# EasyEDA schematic Scout-EasyEDA.json

## Sheets
1 Power-Charge: TITLE: Power/Charge; REV: 1.0; Date: 2020-01-04; Sheet: 1/1; Drawn By: rupertbenbrook; Company: Altitude Angel
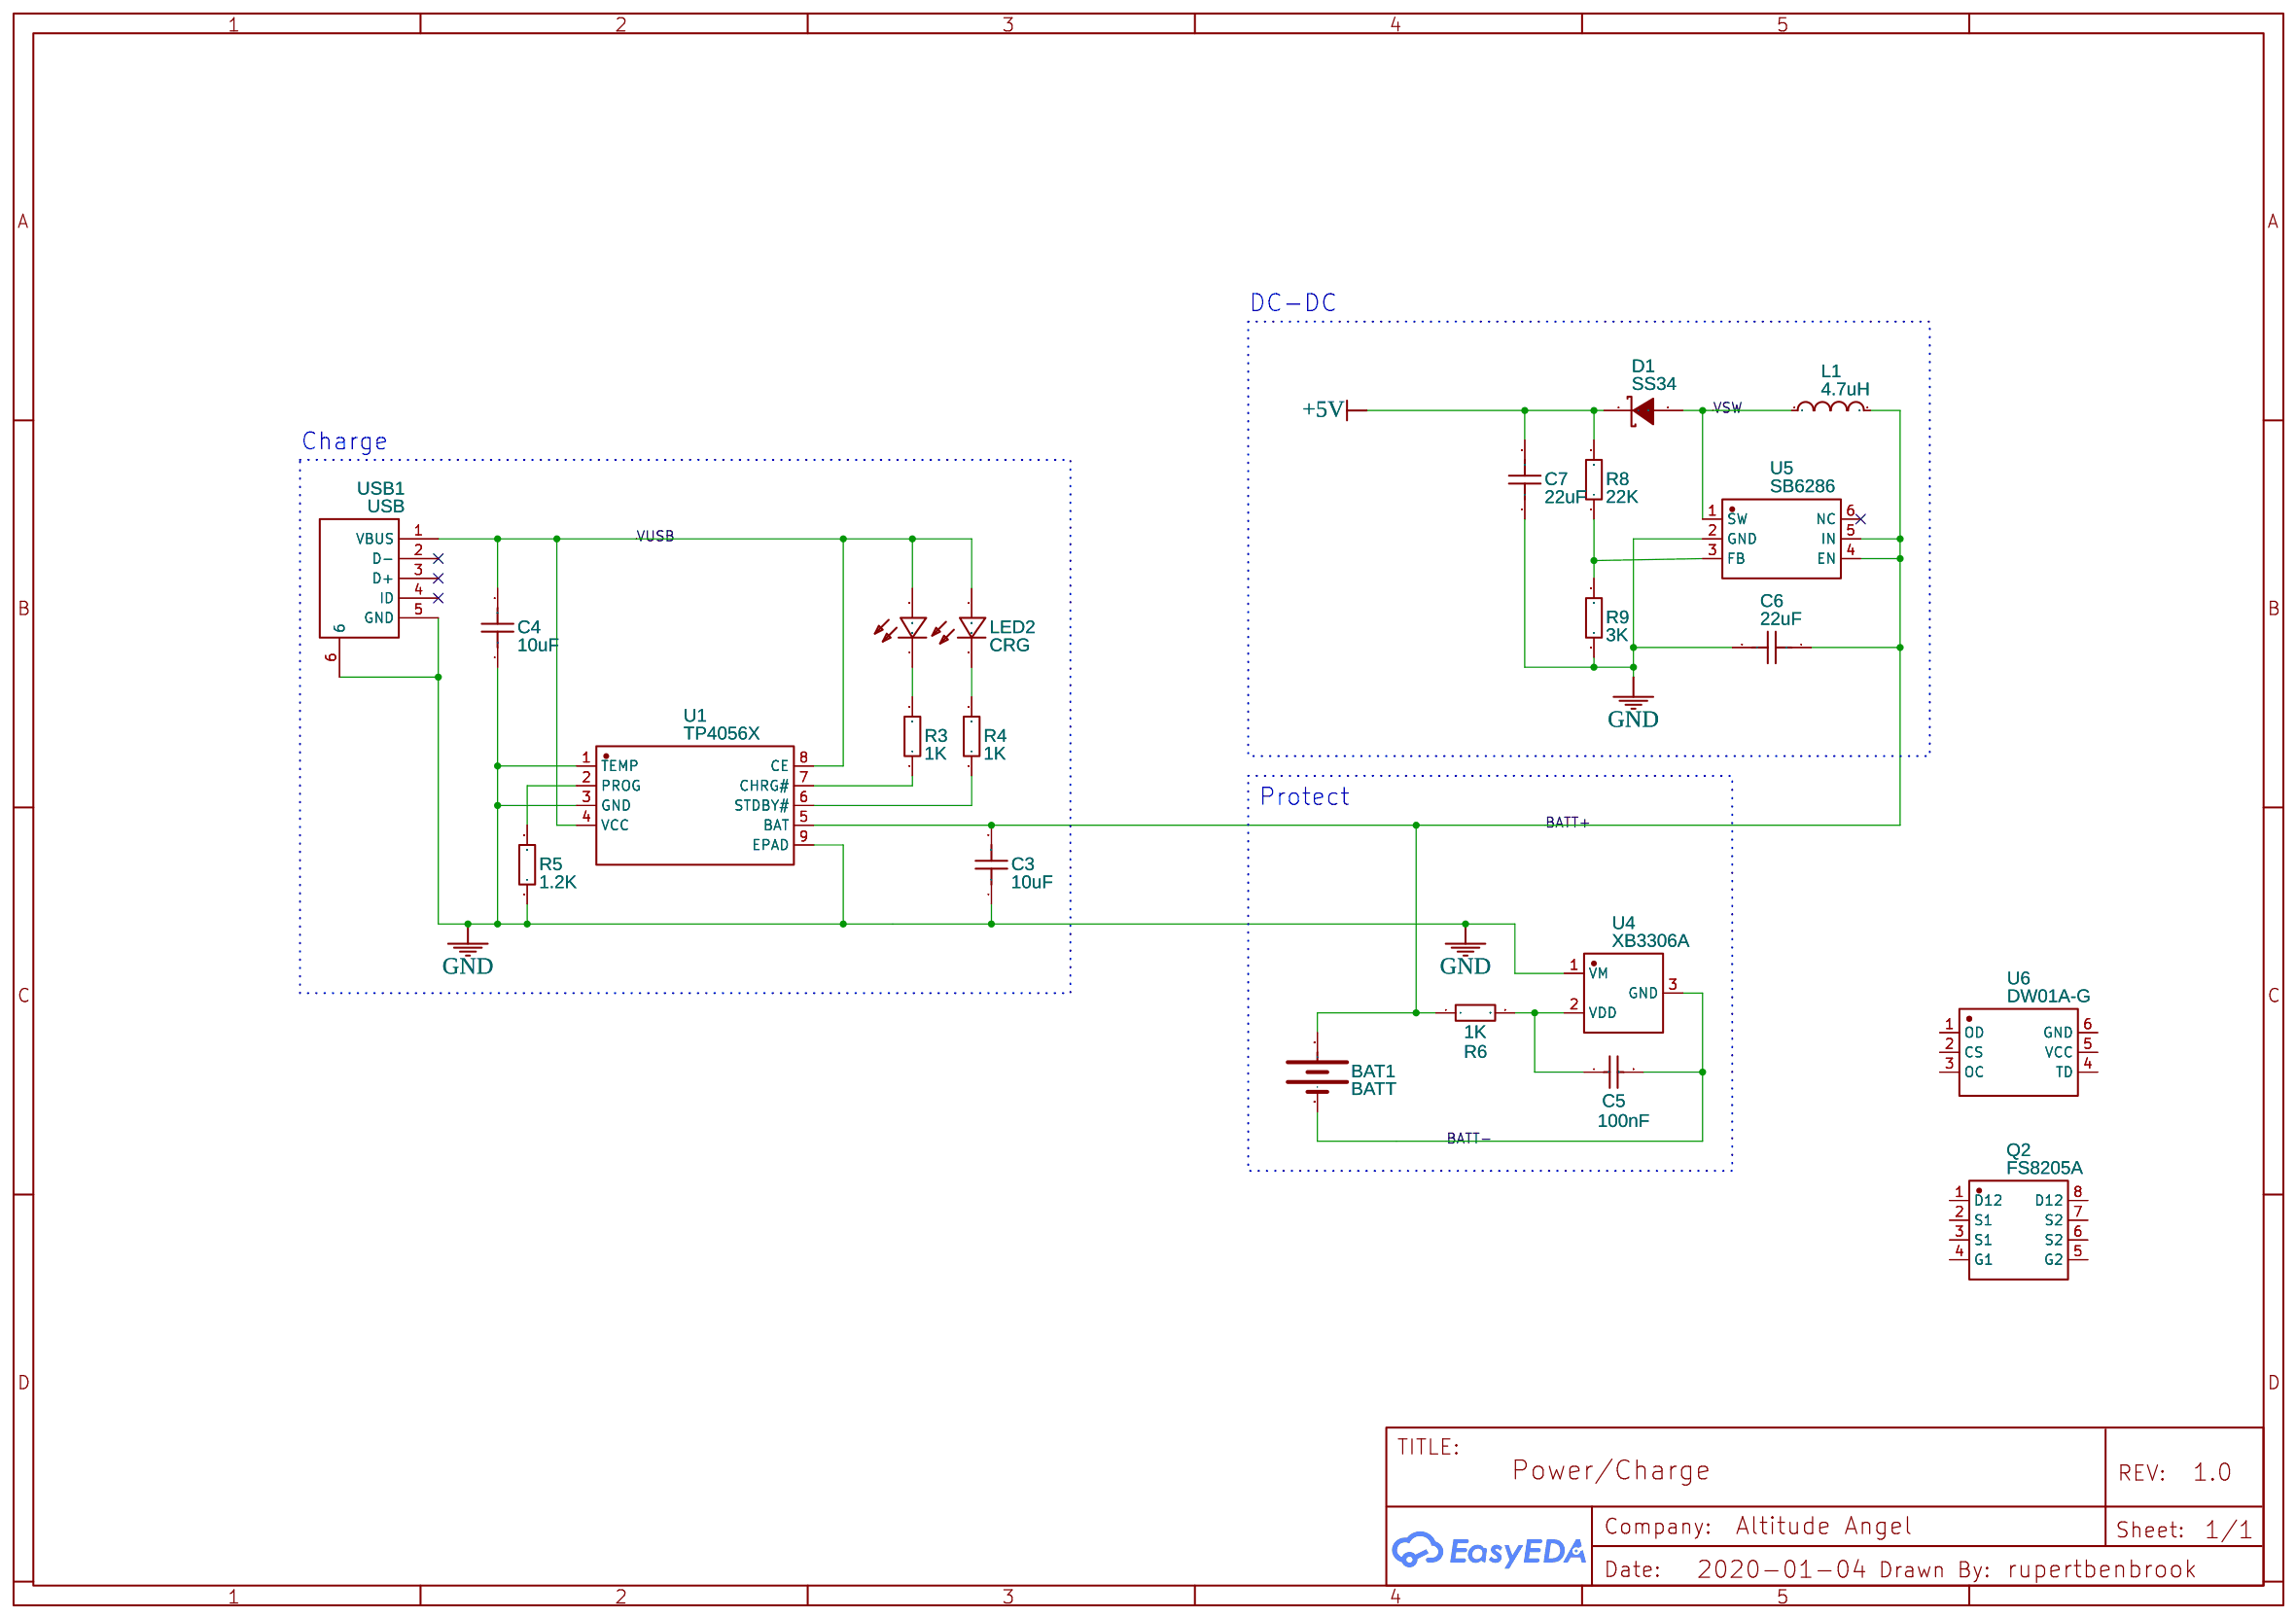
[diagram p0: Power-Charge]
2 Microcontroller: TITLE: Microcontroller
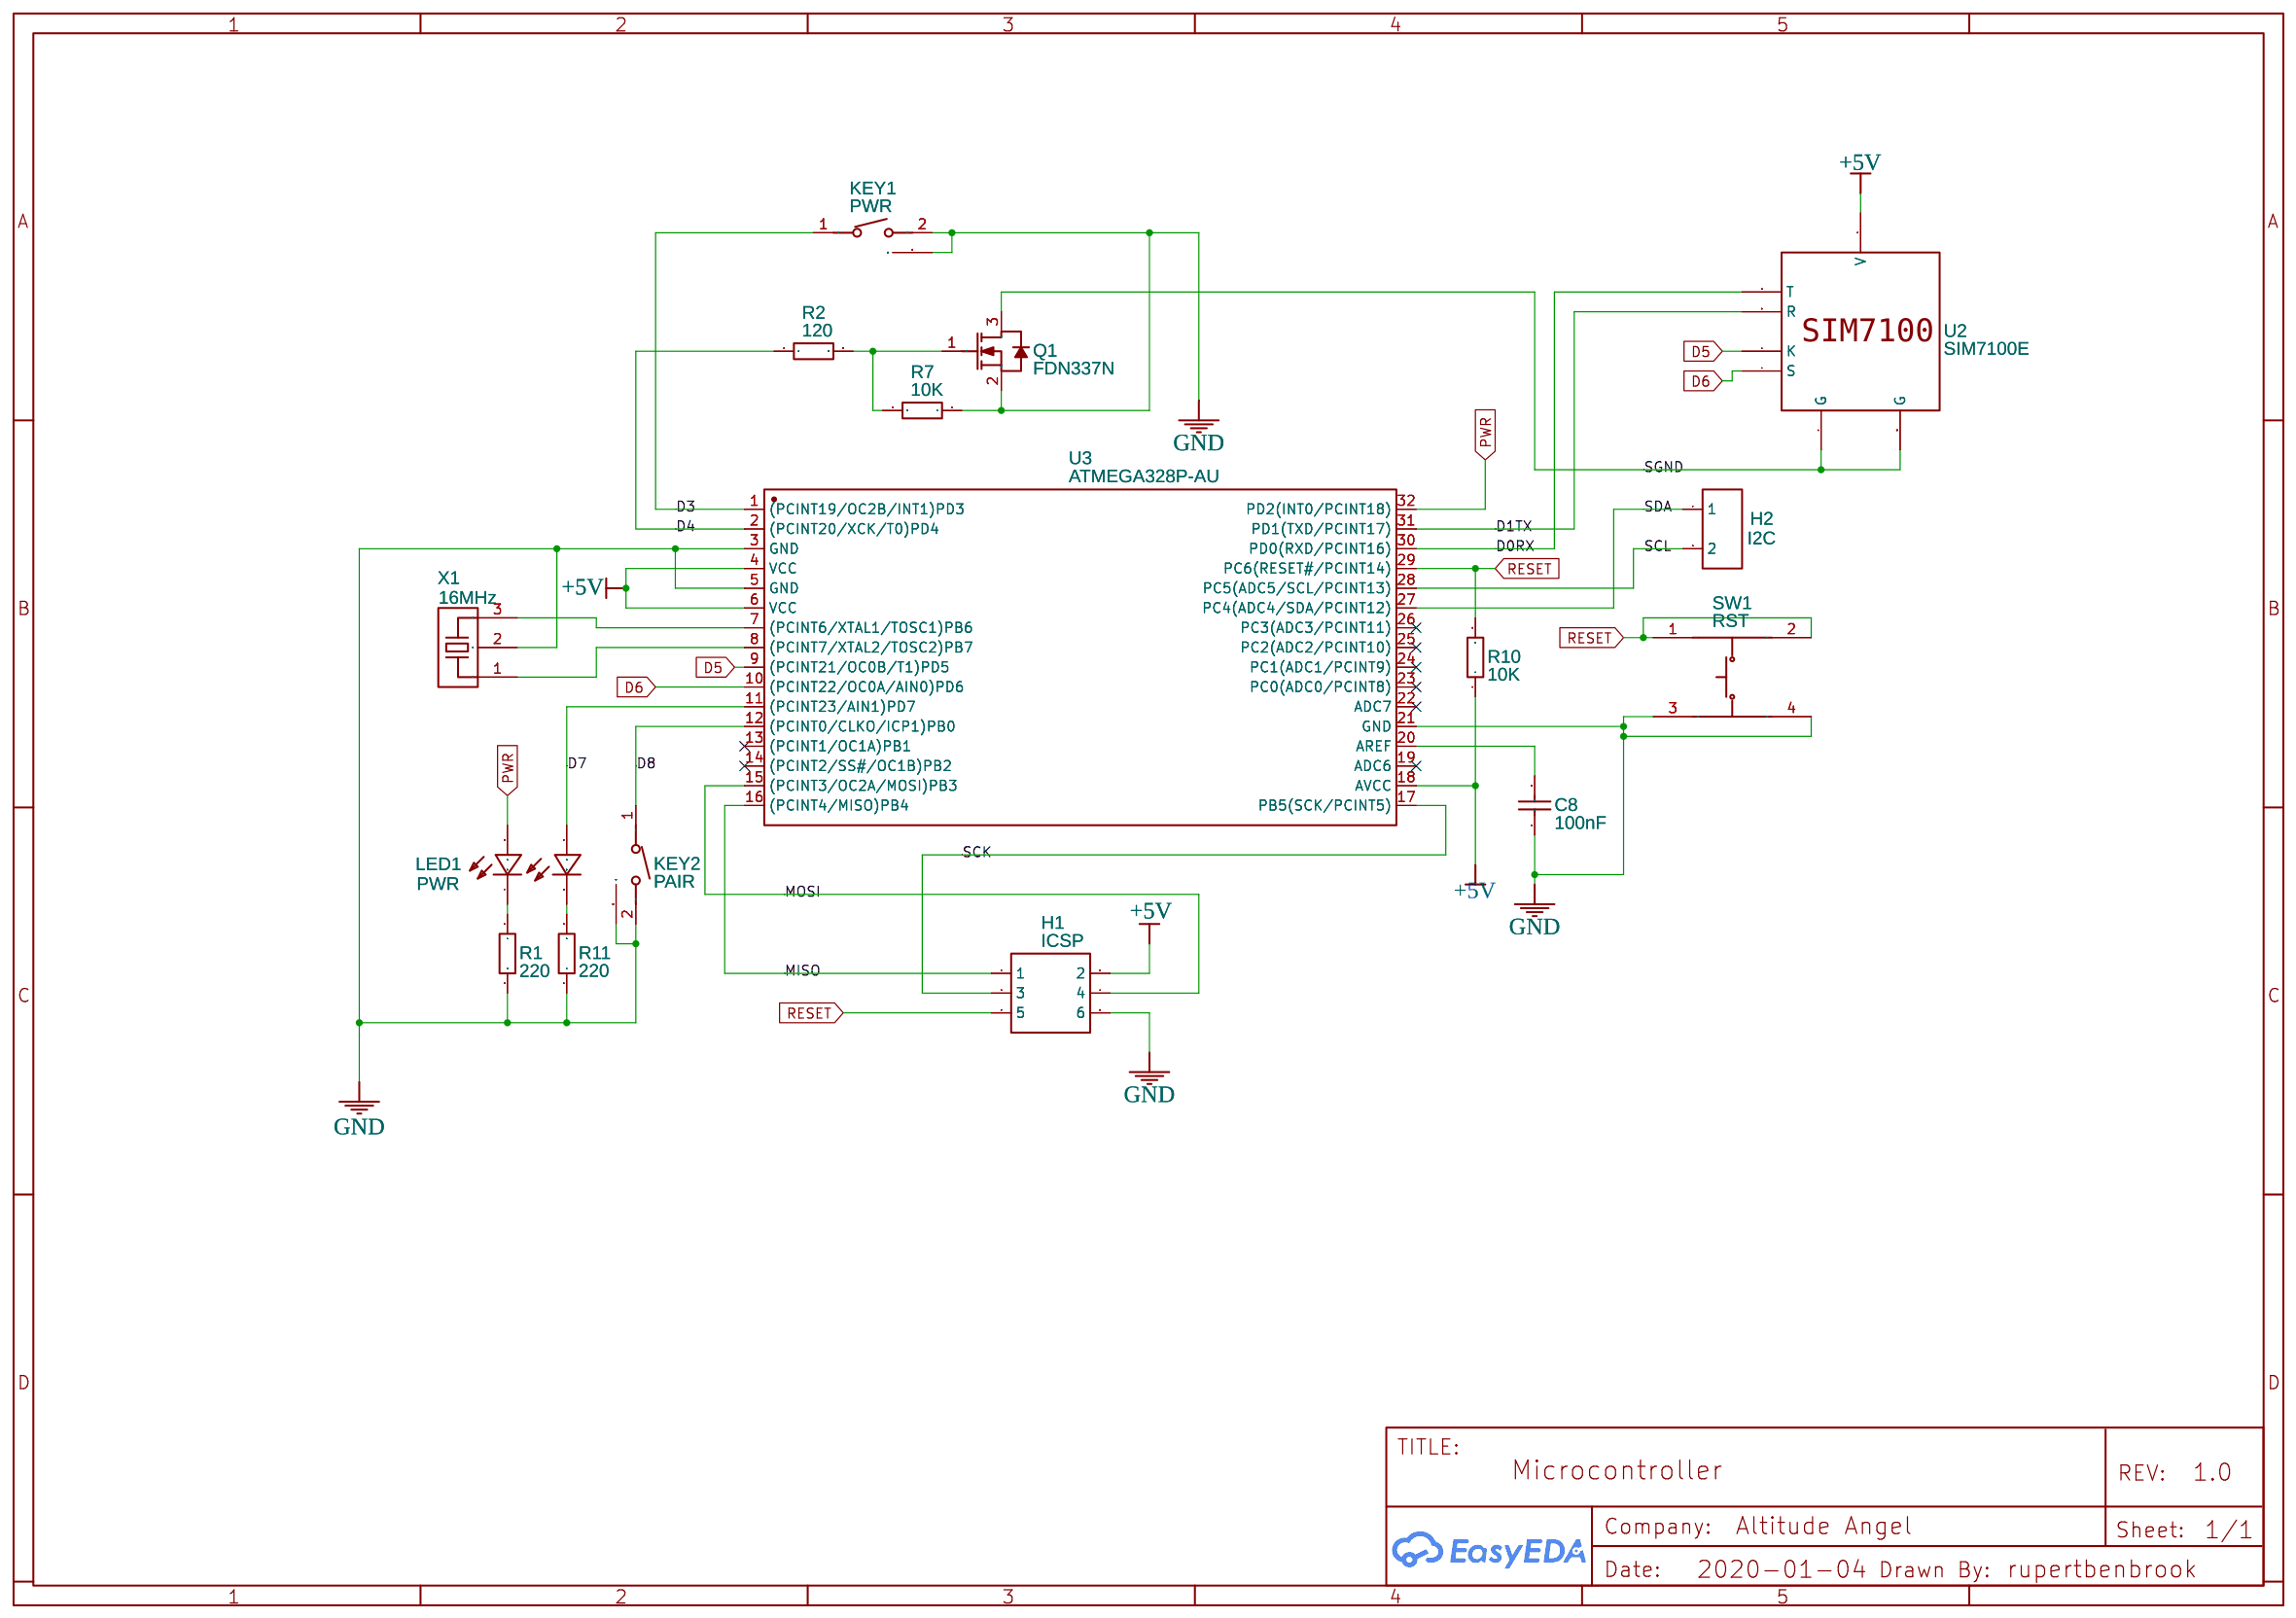
[diagram p1: Microcontroller]

## Parts
sheet Microcontroller
C8  100nF  [C0603]
H1  ICSP  [HDR-TH_6PIN-V-ROW2-COL3-MALE-PITCH2.54]
H2  I2C  [HDR-2X1/2.54]
KEY1  PWR  [KEY-TH_KAN4562-0501C]
KEY2  PAIR  [KEY-TH_KAN4562-0501C]
LED1  PWR  [LED-ARRAY-SMD_0603-4P-L1.6-W1.5-BR-RD]
Q1  FDN337N  [SOT-23-3_L3.0-W1.7-P0.95-LS2.9-BR]
R1  220  [R0603]
R2  120  [R0603]
R7  10K  [R0603]
R10  10K  [R0603]
R11  220  [R0603]
SW1  RST  [KEY-SMD_4P-L3.5-W3.4-P2.20-LS3.9]
U2  SIM7100E  [SIM7100E_MODULE]
U3  ATMEGA328P-AU  [TQFP-32_L7.0-W7.0-P0.80-LS9.0-BL]
X1  16MHz  [OSC-SMD_3P-L3.2-W1.3-P1.2-L]
sheet Power-Charge
BAT1  BATT  [BATTERY_18650-HOLDER]
C3  10uF  [C0603]
C4  10uF  [C0603]
C5  100nF  [C0603]
C6  22uF  [C0603]
C7  22uF  [C0603]
D1  SS34  [SMB_L4.6-W3.6-LS5.3-L-FD]
L1  4.7uH  [IND-SMD_L5.0-W5.0]
LED2  CRG  [LED-ARRAY-SMD_0603-4P-L1.6-W1.5-BR-RD]
Q2  FS8205A  [TSSOP-8_L4.4-W3.5-P0.65-LS6.4-BL]
R3  1K  [R0603]
R4  1K  [R0603]
R5  1.2K  [R0603]
R6  1K  [R0603]
R8  22K  [R0603]
R9  3K  [R0603]
U1  TP4056X  [SOP-8_L4.9-W3.9-P1.27-LS6.0-BL-EP]
U4  XB3306A  [SOT-23(SOT-23-3)]
U5  SB6286  [SOT-23-6_L2.9-W1.6-P0.95-LS2.8-BL]
U6  DW01A-G  [SOT-23-6_L2.9-W1.6-P0.95-LS2.8-BL]
USB1  USB  [MICRO-USB-SMD_5P-P0.65-H-F_MICRO5.9MMUSB]

## Library data of the parts
C5 C8 = GRM188R71C104KA01D: Supplier: LCSC; Manufacturer: MuRata; Supplier Part: C45000
H1 = Header-Male-2.54_2x3: Supplier: LCSC; Manufacturer: BOOMELE; Supplier Part: C65114
H2 = Header-Male-2.54_1x2: Supplier: LCSC; Manufacturer: TE Connectivity; Manufacturer Part: 826629-2; image: //image.lceda.cn/szlcsc/C86471.jpg; Supplier Part: C86471
KEY1 KEY2 = KAN4562-0501C: Supplier: LCSC; Supplier Part: C231728; Manufacturer: GANGYUAN; Contributor: LCSC
LED1 LED2 = LTST-C195KGJRKT: Supplier: LCSC; Supplier Part: C125104; Manufacturer: Lite-On; Contributor: LCSC
Q1 = FDN337N: Supplier: LCSC; Supplier Part: C241805; Manufacturer: ON Semicon; Contributor: LCSC
R1 R11 = RTT032200FTP: Supplier: LCSC; Manufacturer: RALEC; Supplier Part: C103414
R2 = RTT031200FTP: Supplier: LCSC; Manufacturer: RALEC; Supplier Part: C103247
R7 R10 = RTT031002FTP: Supplier: LCSC; Manufacturer: RALEC; Supplier Part: C103199
SW1 = TS-1177-B-A-B: Supplier: LCSC; Supplier Part: C381051; Manufacturer: XKB Enterprise; Contributor: LCSC
U2 = SIM7100E: Manufacturer Part: SIM808; Contributor: thecvely
U3 = ATMEGA328P-AU: Supplier: LCSC; Manufacturer: MICROCHIP; image: //image.lceda.cn/szlcsc/C14877.jpg; Supplier Part: C14877; LCSC Assembly: Yes; SMT Type: Extend
X1 = CSTCE16M0V53-R0: Supplier: LCSC; Manufacturer: MuRata; Supplier Part: C32180
BAT1 = BATTERY18650: Battery Holders; Contributor: SparkFun
C3 C4 = GRM188R61A106KE69D: Supplier: LCSC; Manufacturer: MuRata; Supplier Part: C77044
C6 C7 = GRM188R61A226ME15D: Supplier: LCSC; Manufacturer: MuRata; Supplier Part: C84419
D1 = SS34_C13762: Supplier: LCSC; Manufacturer: MDD; image: //image.lceda.cn/szlcsc/C13762.jpg; Supplier Part: C13762; LCSC Assembly: Yes; SMT Type: Extend
L1 = LQH5BPN4R7NT0L: Supplier: LCSC; Supplier Part: C171792; Manufacturer: Murata Electronics; Contributor: LCSC
Q2 = FS8205A: Supplier: LCSC; Manufacturer: FORTUNE; LCSC Assembly: Yes; image: //image.lceda.cn/szlcsc/C16052.jpg; Supplier Part: C16052; SMT Type: Basic
R3 R4 R6 = RTT031001FTP: Supplier: LCSC; Manufacturer: RALEC; Supplier Part: C103198
R5 = RTT031201FTP: Supplier: LCSC; Manufacturer: RALEC; Supplier Part: C103248
R8 = RTT032202FTP: Supplier: LCSC; Manufacturer: RALEC; Supplier Part: C103416
R9 = RTT033001FTP: Supplier: LCSC; Manufacturer: RALEC; Supplier Part: C103514
U1 = TP4056X: Supplier: LCSC; Supplier Part: C191323; Manufacturer: Nanjing Extension Microelectronics; Contributor: LCSC
U4 = XB3306A: Supplier: LCSC; Manufacturer: Xysemi; Contributor: LCSC; Supplier Part: C154939; LCSC Assembly: Yes; SMT Type: Extend
U5 = SB6286: Supplier: LCSC; Manufacturer: SHOUDING; Contributor: LCSC; Supplier Part: C157668; LCSC Assembly: Yes; SMT Type: Extend
U6 = DW01A-G: Supplier: LCSC; Manufacturer: FORTUNE; Contributor: LCSC; Supplier Part: C61503; LCSC Assembly: Yes; SMT Type: Extend
USB1 = MICRO5.9MMUSB: Supplier: LCSC; Supplier Part: C393940; Manufacturer: SHOU HAN; Manufacturer Part: MICRO5.9mmusb; Contributor: LCSC

## Nets
+5V: C7.2 D1.2(K) H1.2 R8.2 R10.1 U2.5(V) U3.4(VCC) U3.6(VCC) U3.18(AVCC)
GND: C3.1 C4.1 C6.2 C7.1 C8.1 H1.6 KEY1.0 KEY1.2 KEY2.0 KEY2.2 Q1.2(S) R1.2 R5.1 R7.1 R9.1 R11.1 SW1.3 SW1.4 U1.1(TEMP) U1.3(GND) U1.9(EPAD) U3.3(GND) U3.5(GND) U3.21(GND) U4.1(VM) U5.2(GND) USB1.5(GND) USB1.6 X1.2
SGND: Q1.3(D) U2.1(G) U2.6(G)
BATT+: BAT1.PWR(+) C3.2 C6.1 L1.2 R6.1 U1.5(BAT) U5.4(EN) U5.5(IN)
BATT-: BAT1.GND(-) C5.2 U4.3(GND)
D0RX: U2.3(T) U3.30(PD0(RXD/PCINT16))
D1TX: U2.2(R) U3.31(PD1(TXD/PCINT17))
D3: KEY1.1 U3.1((PCINT19/OC2B/INT1)PD3)
D4: R2.1 U3.2((PCINT20/XCK/T0)PD4)
D5: U2.4(K) U3.9((PCINT21/OC0B/T1)PD5)
D6: U2.7(S) U3.10((PCINT22/OC0A/AIN0)PD6)
D7: LED1.1(G+) U3.11((PCINT23/AIN1)PD7)
D8: KEY2.1 U3.12((PCINT0/CLKO/ICP1)PB0)
MISO: H1.1 U3.16((PCINT4/MISO)PB4)
MOSI: H1.4 U3.15((PCINT3/OC2A/MOSI)PB3)
PWR: LED1.2(R+) U3.32(PD2(INT0/PCINT18))
RESET: H1.5 R10.2 SW1.1 SW1.2 U3.29(PC6(RESET#/PCINT14))
SCK: H1.3 U3.17(PB5(SCK/PCINT5))
SCL: H2.2 U3.28(PC5(ADC5/SCL/PCINT13))
SDA: H2.1 U3.27(PC4(ADC4/SDA/PCINT12))
VSW: D1.1(A) L1.1 U5.1(SW)
VUSB: C4.2 LED2.1(G+) LED2.2(R+) U1.4(VCC) U1.8(CE) USB1.1(VBUS)
Net-(C5-1): C5.1 R6.2 U4.2(VDD)
Net-(C8-2): C8.2 U3.20(AREF)
Net-(LED1-3): LED1.3(G-) R11.2
Net-(LED1-4): LED1.4(R-) R1.1
Net-(LED2-3): LED2.3(G-) R4.2
Net-(LED2-4): LED2.4(R-) R3.2
Net-(Q1-1): Q1.1(G) R2.2 R7.2
Net-(R3-1): R3.1 U1.7(CHRG#)
Net-(R4-1): R4.1 U1.6(STDBY#)
Net-(R5-2): R5.2 U1.2(PROG)
Net-(R8-1): R8.1 R9.2 U5.3(FB)
Net-(U3-7): U3.7((PCINT6/XTAL1/TOSC1)PB6) X1.3
Net-(U3-8): U3.8((PCINT7/XTAL2/TOSC2)PB7) X1.1

Not connected (* = marked no-connect by the designer): Q2 1(D12) 2(S1) 3(S1) 4(G1) 5(G2) 6(S2) 7(S2) 8(D12); U3 13((PCINT1/OC1A)PB1)* 14((PCINT2/SS#/OC1B)PB2)* 19(ADC6)* 22(ADC7)* 23(PC0(ADC0/PCINT8))* 24(PC1(ADC1/PCINT9))* 25(PC2(ADC2/PCINT10))* 26(PC3(ADC3/PCINT11))*; U5 6(NC)*; U6 1(OD) 2(CS) 3(OC) 4(TD) 5(VCC) 6(GND); USB1 2(D-)* 3(D+)* 4(ID)*

## Notes on the sheets
sheet 1
- DC-DC
- Charge
- Protect
